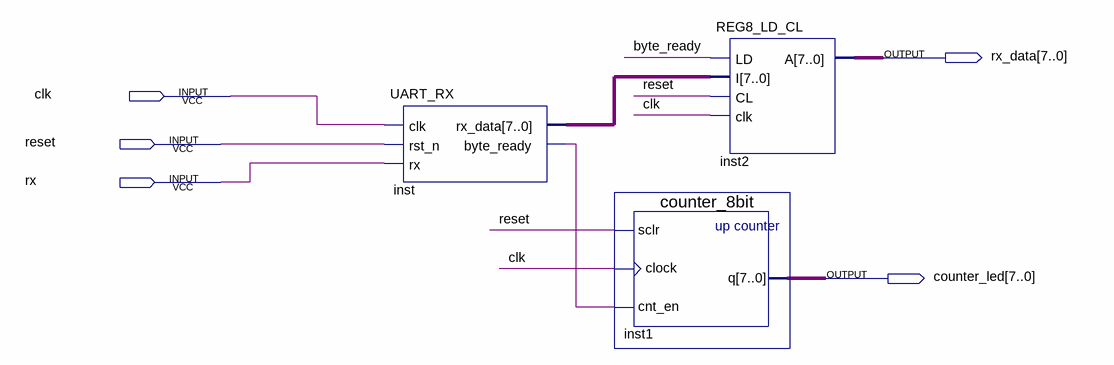
[diagram p0: schematic sheet]
// Quartus schematic UART_RX_TEST.bdf as structural Verilog: 3 symbols, 5 pins
module UART_RX_TEST (
  input  clk,
  input  reset,
  input  rx,
  output [7:0] rx_data,
  output [7:0] counter_led
);

  wire byte_ready, inst_byte_ready;
  wire [7:0] inst_rx_data;

  UART_RX inst (.clk(clk), .rst_n(reset), .rx(rx), .rx_data(inst_rx_data), .byte_ready(inst_byte_ready));
  counter_8bit inst1 (.sclr(reset), .clock(clk), .cnt_en(inst_byte_ready), .q(counter_led));
  REG8_LD_CL inst2 (.LD(byte_ready), .I(inst_rx_data), .CL(reset), .clk(clk), .A(rx_data));
endmodule
